# EAGLE schematic placa_motor_v1 (EAGLE 7.5.0)
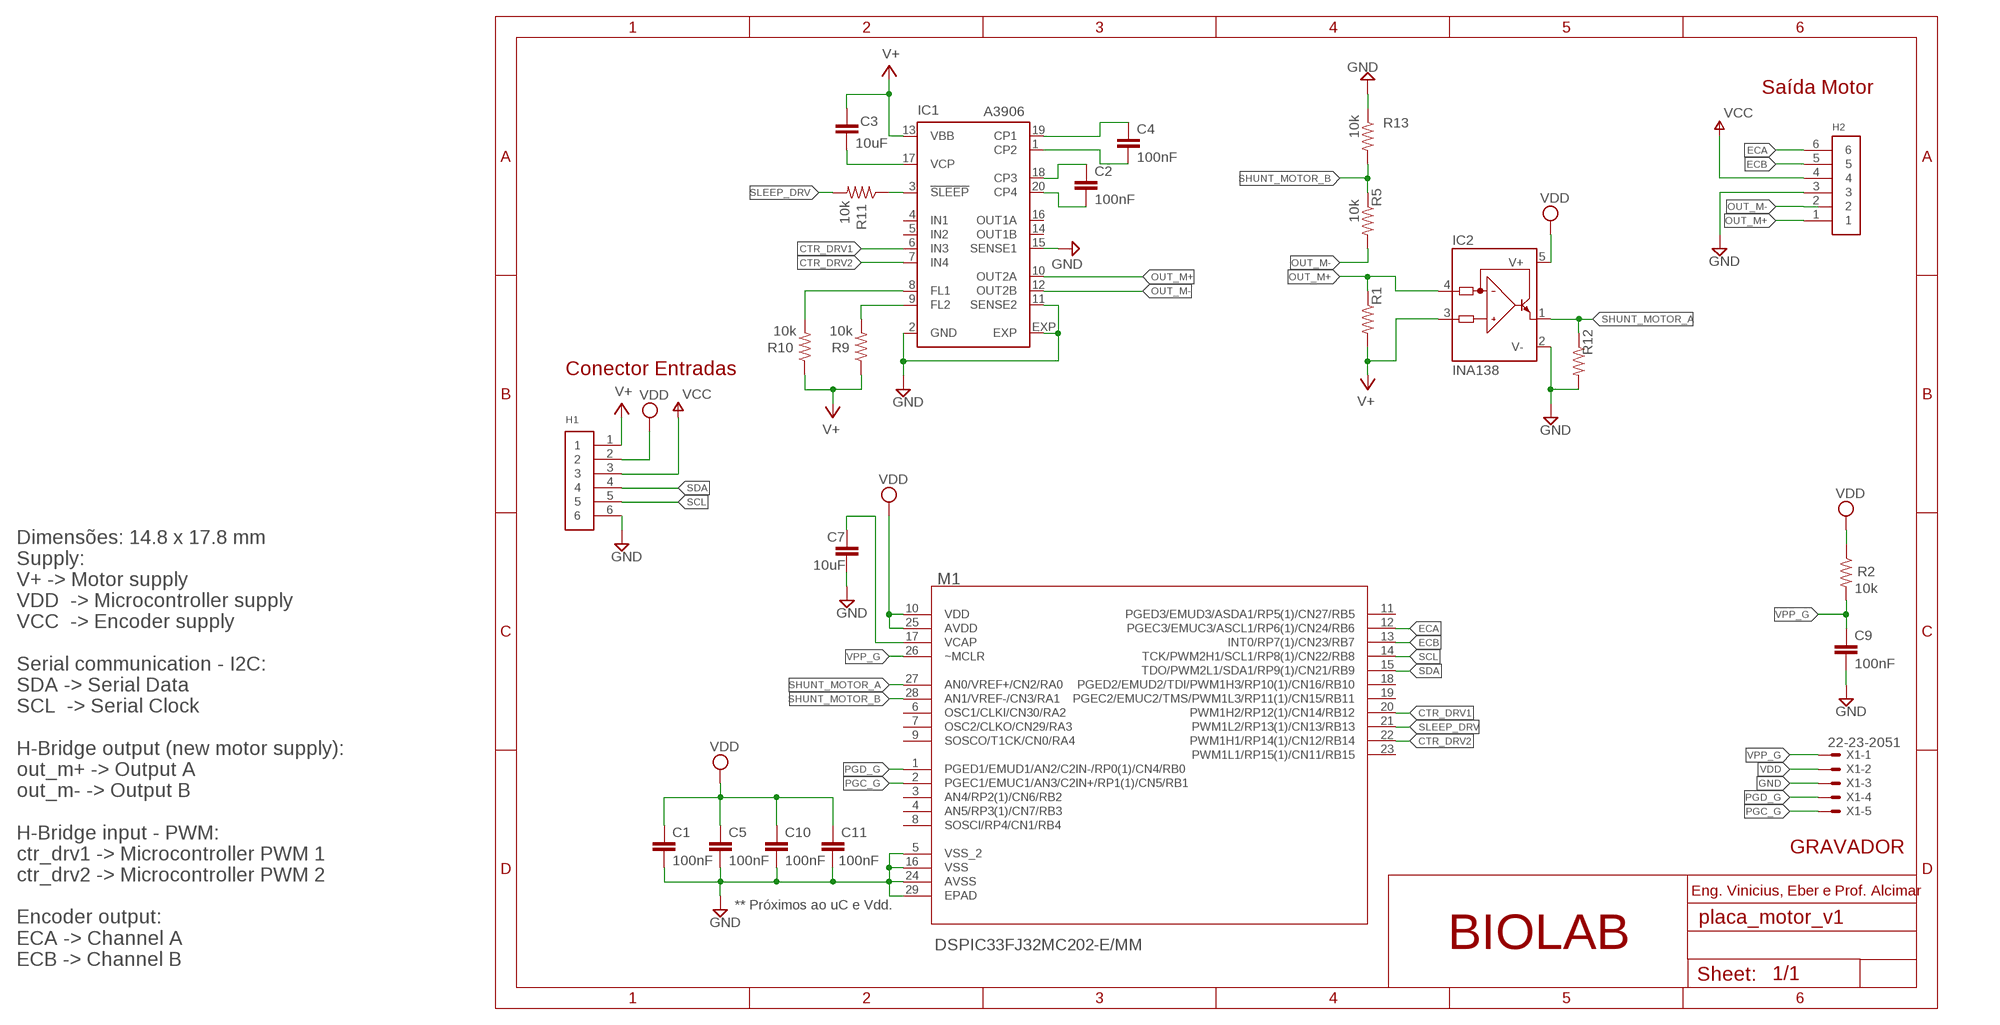
[diagram p0: schematic, sheet 1]

## Parts
C1  100nF  CAPACITOR_0805_M  [RESC0805_M]
C2  100nF  CAPACITOR_0805_M  [RESC0805_M]
C3  10uF  CAPACITOR_0805_M  [RESC0805_M]
C4  100nF  CAPACITOR_0805_M  [RESC0805_M]
C5  100nF  CAPACITOR_0805_M  [RESC0805_M]
C7  10uF  CAPACITOR_0805_M  [RESC0805_M]
C9  100nF  CAPACITOR_0805_M  [RESC0805_M]
C10  100nF  CAPACITOR_0805_M  [RESC0805_M]
C11  100nF  CAPACITOR_0805_M  [RESC0805_M]
H1  61300611121  [61300611121]
H2  61300611121  [61300611121]
IC1  A3906  [QFN20]
IC2  INA138  [SOT23-5]
M1  DSPIC33FJ32MC202-E/MM  [QFN65P600X600X100-29N]
R1  R-US_R0805  [R0805]
R2  10k  R-US_R0805  [R0805]
R5  10k  R-US_R0805  [R0805]
R9  10k  R-US_R0805  [R0805]
R10  10k  R-US_R0805  [R0805]
R11  10k  R-US_R0805  [R0805]
R12  R-US_R0805  [R0805]
R13  10k  R-US_R0805  [R0805]
X1  22-23-2051  [22-23-2051]

## Nets
CTR_DRV1: IC1.6(IN3) M1.20(PWM1H2/RP12(1)/CN14/RB12)
CTR_DRV2: IC1.7(IN4) M1.22(PWM1H1/RP14(1)/CN12/RB14)
ECA: H2.6 M1.12(PGEC3/EMUC3/ASCL1/RP6(1)/CN24/RB6)
ECB: H2.5 M1.13(INT0/RP7(1)/CN23/RB7)
GND: C1.2 C5.2 C7.2 C9.2 C10.2 C11.2 H1.6 H2.3 IC1.2(GND) IC1.11(SENSE2) IC1.15(SENSE1) IC1.EXP IC2.2(V-) M1.5(VSS_2) M1.16(VSS) M1.24(AVSS) M1.29(EPAD) R12.2 R13.1 X1.3
N$3: IC1.8(FL1) R10.2
N$5: C3.2 IC1.17(VCP)
N$6: IC1.9(FL2) R9.2
N$7: IC1.3(!SLEEP) R11.1
N$11: C7.1 M1.17(VCAP)
N$12: C4.2 IC1.1(CP2)
N$22: C2.1 IC1.18(CP3)
N$23: C2.2 IC1.20(CP4)
N$24: C4.1 IC1.19(CP1)
OUT_M+: H2.1 IC1.10(OUT2A) IC2.4(IN-) R1.1
OUT_M-: H2.2 IC1.12(OUT2B) R5.2
PGC_G: M1.2(PGEC1/EMUC1/AN3/C2IN+/RP1(1)/CN5/RB1) X1.5
PGD_G: M1.1(PGED1/EMUD1/AN2/C2IN-/RP0(1)/CN4/RB0) X1.4
SCL: H1.5 M1.14(TCK/PWM2H1/SCL1/RP8(1)/CN22/RB8)
SDA: H1.4 M1.15(TDO/PWM2L1/SDA1/RP9(1)/CN21/RB9)
SHUNT_MOTOR_A: IC2.1(OUT) M1.27(AN0/VREF+/CN2/RA0) R12.1
SHUNT_MOTOR_B: M1.28(AN1/VREF-/CN3/RA1) R5.1 R13.2
SLEEP_DRV: M1.21(PWM1L2/RP13(1)/CN13/RB13) R11.2
V+: C3.1 H1.1 H1.3 H2.4 IC1.13(VBB) IC2.3(IN+) R1.2 R9.1 R10.1 ; supply symbol labelled VCC
VDD: C1.1 C5.1 C10.1 C11.1 H1.2 IC2.5(V+) M1.10(VDD) M1.25(AVDD) R2.1 X1.2
VPP_G: C9.1 M1.26(~MCLR) R2.2 X1.1
Unconnected: IC1.4(IN1) IC1.5(IN2) IC1.14(OUT1B) IC1.16(OUT1A) M1.3(AN4/RP2(1)/CN6/RB2) M1.4(AN5/RP3(1)/CN7/RB3) M1.6(OSC1/CLKI/CN30/RA2) M1.7(OSC2/CLKO/CN29/RA3) M1.8(SOSCI/RP4/CN1/RB4) M1.9(SOSCO/T1CK/CN0/RA4) M1.11(PGED3/EMUD3/ASDA1/RP5(1)/CN27/RB5) M1.18(PGED2/EMUD2/TDI/PWM1H3/RP10(1)/CN16/RB10) M1.19(PGEC2/EMUC2/TMS/PWM1L3/RP11(1)/CN15/RB11) M1.23(PWM1L1/RP15(1)/CN11/RB15)

## Notes on the sheet
- Saída Motor
- Conector Entradas
- Dimensões: 14.8 x 17.8 mm
- GRAVADOR
- Eng. Vinicius, Eber e Prof. Alcimar
- ** Próximos ao uC e Vdd.
- BIOLAB
- Supply:
  V+ -> Motor supply
  VDD  -> Microcontroller supply
  VCC  -> Encoder supply
  
  Serial communication - I2C:
  SDA -> Serial Data
  SCL  -> Serial Clock
  
  H-Bridge output (new motor supply):
  out_m+ -> Output A
  out_m- -> Output B
  
  H-Bridge input - PWM:
  ctr_drv1 -> Microcontroller PWM 1
  ctr_drv2 -> Microcontroller PWM 2
  
  Encoder output:
  ECA -> Channel A 
  ECB -> Channel B

## Library data of the parts
C1-C5 C7 C9-C11 = Nordic_nRF:CAPACITOR: Generic chip capacitor
H1 H2 = Headers:61300611121: CONN HEADER VERT 6POS 2.54MM Manufacturer's datasheet <https://katalog.we-online.de/em/datasheet/6130xx11121.pdf>; CREATED_BY: PCBLayout.com; DIGI_KEY_PART_NUMBER: 732-5319-ND; MANUFACTURER: Wurth Electronics Inc.; MPN: 61300611121
IC1 = allegro:A3906: Low Voltage Stepper and Single/Dual DC Motor Driver Data Sheet <http://www.allegromicro.com/en/Products/Part_Numbers/3906/3906.pdf>
IC2 = burr-brown:INA138: High-Side Measurement Current Shunt Monitor; MF: TEXAS INSTRUMENTS; MPN: INA138NA/250; OC_FARNELL: 1564888; OC_NEWARK: 80K5906
M1 = DSPIC33FJ32MC202-E_MM:DSPIC33FJ32MC202-E/MM: 16-bit Digital Signal Controllers; DESCRIPTION: dsPIC Automotive, AEC-Q100, dsPIC™ 33F Microcontroller IC 16-Bit 40 MIPs 32KB _32K x 8_ FLASH 28-QFN-S _6x6_; DIGI-KEY_PART_NUMBER: DSPIC33FJ32MC202-E/MM-ND; DIGI-KEY_PURCHASE_URL: https://www.digikey.com/product-detail/en/microchip-technology/DSPIC33FJ32MC202-E-MM/DSPIC33FJ32MC202-E-MM-ND/1635835?utm_source=snapeda&utm_medium=aggregator&utm_campaign=symbol; MF: Microchip; MP: DSPIC33FJ32MC202-E/MM; PACKAGE: QFN-28 Microchip
R1 R2 R5 R9-R13 = BeagleBone_Black_Wireless:R-US_: RESISTOR, American symbol
X1 = con-molex:22-23-2051: .100" (2.54mm) Center Header - 5 Pin; MF: MOLEX; MPN: 22-23-2051; OC_FARNELL: 1462952; OC_NEWARK: 38C9178